# Altium schematic sheet eps_bt2.SchDoc
size A4
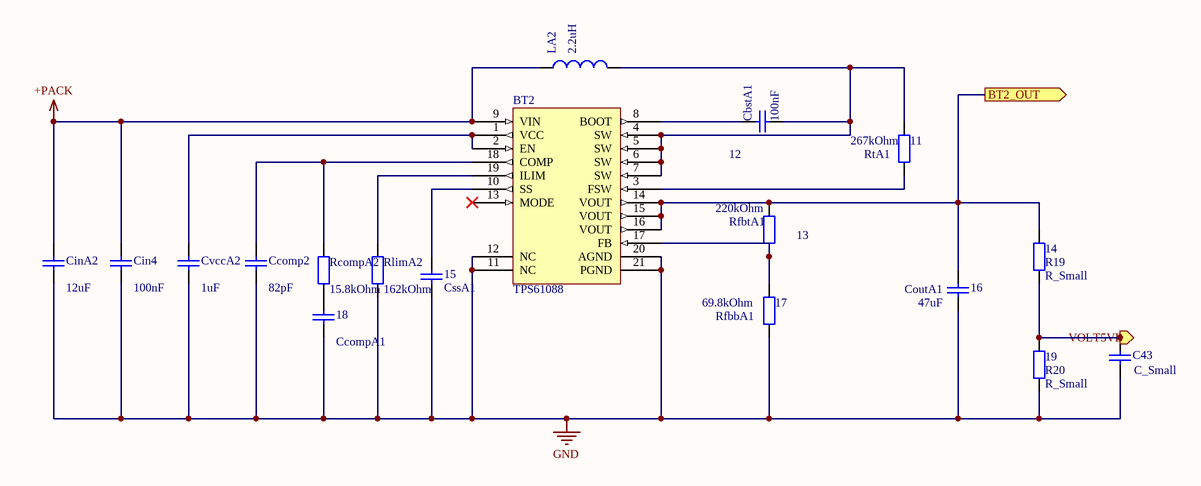
[diagram p0: eps_bt2.SchDoc]

## Parts
11  RtA1  value 267kOhm  [1608[0603]]
12  CbstA1  value 100nF  [1608[0603]]
13  RfbtA1  value 220kOhm  [1608[0603]]
14  R19  value R_Small  [1608[0603]]
15  CssA1  [1608[0603]]
16  CoutA1  value 47uF  [1608[0603]]
17  RfbbA1  value 69.8kOhm  [1608[0603]]
18  value CcompA1  [1608[0603]]
19  R20  value R_Small  [1608[0603]]
BT2  TPS61088  [QFN50P450X350X100-21N]
C43  value C_Small  [1608[0603]]
Ccomp2  value 82pF  [1608[0603]]
Cin4  value 100nF  [1608[0603]]
CinA2  value 12uF  [1608[0603]]
CvccA2  value 1uF  [1608[0603]]
LA2  value 2.2uH  [1608[0603]]
RcompA2  value 15.8kOhm  [1608[0603]]
RlimA2  value 162kOhm  [1608[0603]]

## Ports
BT2_OUT (out), VOLT5VB (out)

## Nets
+PACK: BT2.9(VIN) Cin4.2 CinA2.2 LA2.1
GND: 15.1 16.1 17.1 18.1 19.1 BT2.11(NC) BT2.12(NC) BT2.20(AGND) BT2.21(PGND) C43.2 Ccomp2.1 Cin4.1 CinA2.1 CvccA2.1 RlimA2.1
BT2_OUT: 13.2 14.2 16.2 BT2.14(VOUT) BT2.15(VOUT) BT2.16(VOUT) ; port BT2_OUT
VOLT5VB: 14.1 19.2 C43.1 ; port VOLT5VB
Net11_1: 11.1 12.1 BT2.4(SW) BT2.5(SW) BT2.6(SW) BT2.7(SW) LA2.2
Net11_2: 11.2 BT2.3(FSW)
Net12_2: 12.2 BT2.8(BOOT)
Net13_1: 13.1 17.2 BT2.17(FB)
Net15_2: 15.2 BT2.10(SS)
Net18_2: 18.2 RcompA2.1
NetBT2_1: BT2.1(VCC) BT2.2(EN) CvccA2.2
NetBT2_18: BT2.18(COMP) Ccomp2.2 RcompA2.2
NetBT2_19: BT2.19(ILIM) RlimA2.2

Not connected (* = marked no-connect by the designer): BT2 13(MODE)*

## Library data of the parts
11 13 14 17 19 RcompA2 RlimA2 = Res2: Resistor; Published: 8-Jun-2000; LatestRevisionDate: 17-Jul-2002; LatestRevisionNote: Re-released for DXP Platform.; PackageReference: AXIAL-0.4; Publisher: Altium Limited; PackageDescription: Axial Device, Thru-Hole; 2 Leads; 0.4 in Pin Spacing
12 15 16 18 C43 Ccomp2 Cin4 CinA2 CvccA2 = Cap: Capacitor; Published: 8-Jun-2000; LatestRevisionDate: 17-Jul-2002; LatestRevisionNote: Re-released for DXP Platform.; PackageReference: RAD-0.3; Publisher: Altium Limited; PackageDescription: Radial Cap, Thru-Hole; 2 Leads; 0.3 in Pin Spacing
BT2 = TPS61088: Boost converter
LA2 = Inductor: Code_IEC: 1005; Published: 8-Jun-2000; LatestRevisionDate: 29-May-2009; LatestRevisionNote: IPC-7351 Footprint Added.; PackageReference: 0402-A; Publisher: Altium Limited; PackageDescription: Chip Inductor; Code_JEITA: 0402